# Altium project VCU 2.0.PrjPcb
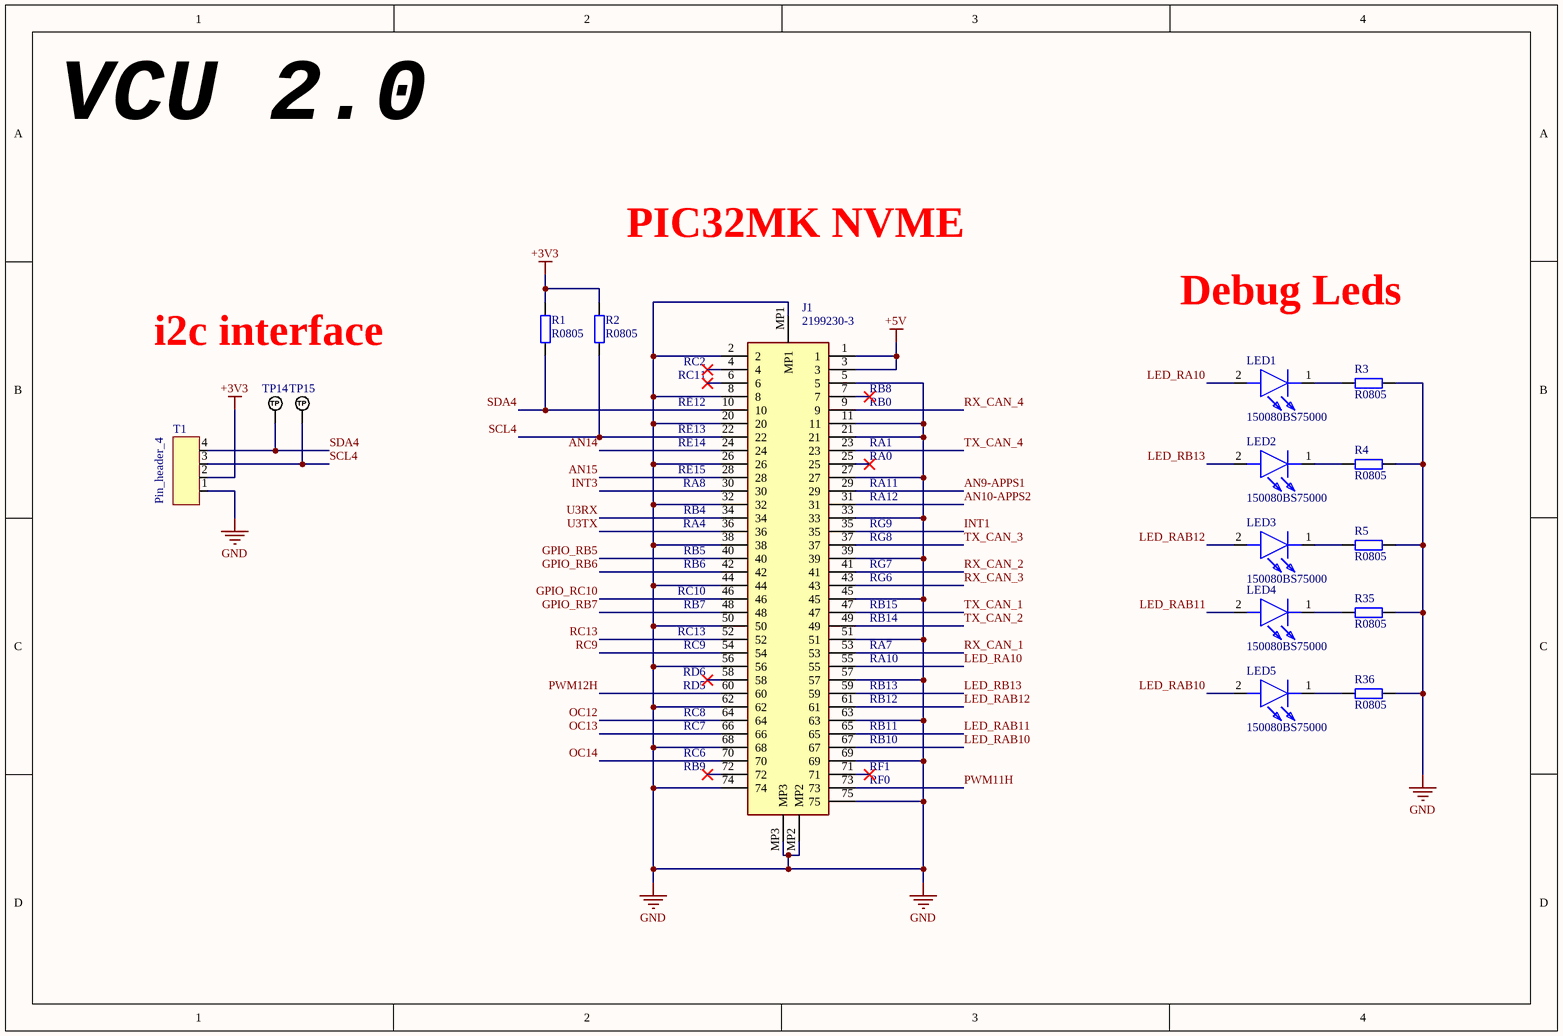
[diagram p0: PIC32_NVME.SchDoc]
6 sheets, 138 parts. Net scope: global (net labels, ports and power ports of the same name join across sheets).
Board file: VCU_V2_PCB.PcbDoc
Sheets:
  PIC32_NVME.SchDoc
  POWER.SchDoc
  CAN.SchDoc
  APPS.SchDoc
  MOSFETS.SchDoc
  OUTPUT.SchDoc

## Sheet PIC32_NVME.SchDoc
size A4; SheetNumber: 1; SheetTotal: 6

### Parts
J1  2199230-3  [21992303]
LED1  150080BS75000  [LEDC2012X80N]
LED2  150080BS75000  [LEDC2012X80N]
LED3  150080BS75000  [LEDC2012X80N]
LED4  150080BS75000  [LEDC2012X80N]
LED5  150080BS75000  [LEDC2012X80N]
R1  R0805  [RES_0805]
R2  R0805  [RES_0805]
R3  R0805  [RES_0805]
R4  R0805  [RES_0805]
R5  R0805  [RES_0805]
R35  R0805  [RES_0805]
R36  R0805  [RES_0805]
T1  Pin_header_4  [Pin_header_4]
TP14  TP_NOBOM  [PAD_RND_1MM]  (value not drawn)  (no BOM)
TP15  TP_NOBOM  [PAD_RND_1MM]  (value not drawn)  (no BOM)

### Nets
+3V3: R1.1 R2.1 T1.2
+5V: J1.1 J1.3
GND: J1.2 J1.5 J1.8 J1.11 J1.20 J1.21 J1.26 J1.27 J1.32 J1.33 J1.38 J1.39 J1.44 J1.45 J1.50 J1.51 J1.56 J1.57 J1.62 J1.63 J1.68 J1.69 J1.74 J1.75 J1.MP1 J1.MP2 J1.MP3 R3.1 R4.1 R5.1 R35.1 R36.1 T1.1
AN9-APPS1: J1.29
AN10-APPS2: J1.31
AN14: J1.24
AN15: J1.28
GPIO_RB5: J1.40
GPIO_RB6: J1.42
GPIO_RB7: J1.48
GPIO_RC10: J1.46
INT1: J1.35
INT3: J1.30
LED_RA10: J1.55 LED1.2(A)
LED_RAB10: J1.67 LED5.2(A)
LED_RAB11: J1.65 LED4.2(A)
LED_RAB12: J1.61 LED3.2(A)
LED_RB13: J1.59 LED2.2(A)
OC12: J1.64
OC13: J1.66
OC14: J1.70
PWM11H: J1.73
PWM12H: J1.60
RC9: J1.54
RC13: J1.52
RX_CAN_1: J1.53
RX_CAN_2: J1.41
RX_CAN_3: J1.43
RX_CAN_4: J1.9
SCL4: J1.22 R2.2 T1.3 TP15.1(TP)
SDA4: J1.10 R1.2 T1.4 TP14.1(TP)
TX_CAN_1: J1.47
TX_CAN_2: J1.49
TX_CAN_3: J1.37
TX_CAN_4: J1.23
U3RX: J1.34
U3TX: J1.36
NetLED1_1: LED1.1(K) R3.2
NetLED2_1: LED2.1(K) R4.2
NetLED3_1: LED3.1(K) R5.2
NetLED4_1: LED4.1(K) R35.2
NetLED5_1: LED5.1(K) R36.2

Not connected (* = marked no-connect by the designer): J1 4* 6* 7* 25* 58* 71* 72*

### Notes on the sheet
- VCU 2.0
- PIC32MK NVME
- Debug Leds
- i2c interface
- (near J1) RC2
- (near J1) RC11
- (near J1) RE12
- (near J1) RE13
- (near J1) RE14
- (near J1) RB0
- (near J1) RA1
- (near J1) RB8
- (near J1) RE15
- (near J1) RA8
- (near J1) RB4
- (near J1) RA0
- (near J1) RA11
- (near J1) RA12
- (near J1) RA4
- (near J1) RB5
- (near J1) RB6
- (near J1) RG7
- (near J1) RG8
- (near J1) RG6
- (near J1) RG9
- (near J1) RC10
- (near J1) RB7
- (near J1) RC13
- (near J1) RC9
- (near J1) RA7
- (near J1) RB15
- (near J1) RB14
- (near J1) RD6
- (near J1) RD5
- (near J1) RC8
- (near J1) RA10
- (near J1) RB13
- (near J1) RB12
- (near J1) RC7
- (near J1) RC6
- (near J1) RB9
- (near J1) RB11
- (near J1) RB10
- (near J1) RF1
- (near J1) RF0

### Library data of the parts
J1 = 2199230-3: Connector; Manufacturer_Name: TE Connectivity; Datasheet Link: https://componentsearchengine.com/Datasheets/2/2199230-3.pdf; Height: 4.2mm; Manufacturer_Part_Number: 2199230-3; Mouser Part Number: 571-2199230-3; Mouser Price/Stock: https://www.mouser.co.uk/ProductDetail/TE-Connectivity/2199230-3?qs=EQCnRgr4b6HElQOKr5ma1Q%3D%3D; Arrow Part Number: 2199230-3; Arrow Price/Stock: https://www.arrow.com/en/products/2199230-3/te-connectivity?region=nac
LED1-LED5 = 150080BS75000: LED; Manufacturer_Name: Wurth Elektronik; Datasheet Link: https://katalog.we-online.com/led/datasheet/150080BS75000.pdf; Height: 0.8mm; Manufacturer_Part_Number: 150080BS75000; Mouser Part Number: 710-150080BS75000; Mouser Price/Stock: https://www.mouser.co.uk/ProductDetail/Wurth-Elektronik/150080BS75000?qs=2kOmHSv6VfT2tBo3UPVqAQ%3D%3D
R1-R5 R35 R36 = RES_0805: Resistor SMD 0805; Manufacturer: *; Manufacturer Part Number: *; Distributor Link: *; LCSC: *
TP14 TP15 = TEST_POINT_RND_1MM: Test Point Round 1mm (NO BOM)

## Sheet POWER.SchDoc
size A4; SheetNumber: 2; SheetTotal: 6
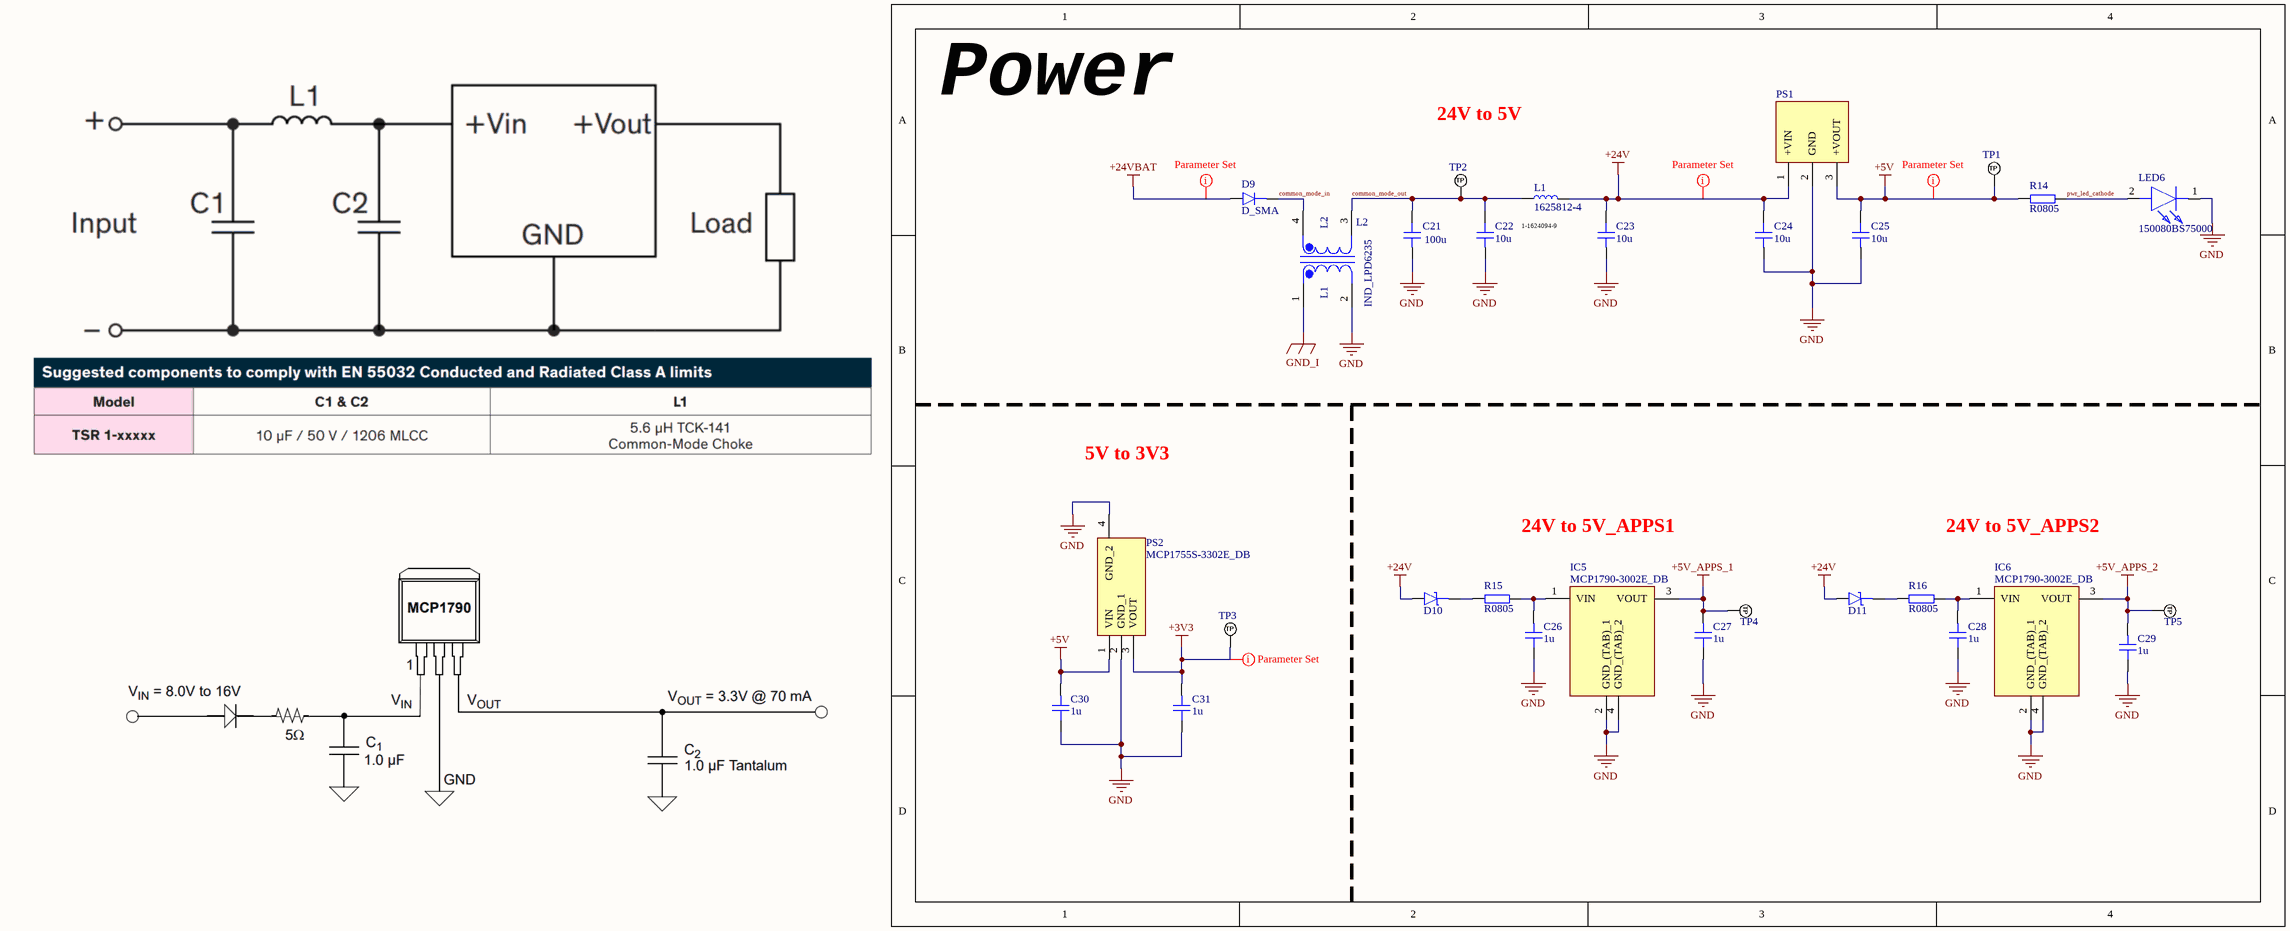
[diagram p1: POWER.SchDoc]

### Parts
C21  100u  [CAP_0805]
C22  10u  [CAP_0805]
C23  10u  [CAP_0805]
C24  10u  [CAP_0805]
C25  10u  [CAP_0805]
C26  1u  [CAP_0805]
C27  1u  [CAP_0805]
C28  1u  [CAP_0805]
C29  1u  [CAP_0805]
C30  1u  [CAP_0805]
C31  1u  [CAP_0805]
D9  D_SMA  [DO-214AC-2 (SMA)]
D10  D_SCHOTTKY_SOD_323  [SOD-323]  (value not drawn)
D11  D_SCHOTTKY_SOD_323  [SOD-323]  (value not drawn)
IC5  MCP1790-3002E_DB  [SOT230P700X180-4N]
IC6  MCP1790-3002E_DB  [SOT230P700X180-4N]
L1  1625812-4  [147873-2 smd button]
L2  IND_LPD6235  [IND_LPD6235]
LED6  150080BS75000  [LEDC2012X80N]
PS1  R-78E5.0-0.5  [R78E5005]  (value not drawn)
PS2  MCP1755S-3302E_DB  [SOT230P700X180-4N]
R14  R0805  [RES_0805]
R15  R0805  [RES_0805]
R16  R0805  [RES_0805]
TP1  TP_NOBOM  [PAD_RND_1MM]  (value not drawn)  (no BOM)
TP2  TP_NOBOM  [PAD_RND_1MM]  (value not drawn)  (no BOM)
TP3  TP_NOBOM  [PAD_RND_1MM]  (value not drawn)  (no BOM)
TP4  TP_NOBOM  [PAD_RND_1MM]  (value not drawn)  (no BOM)
TP5  TP_NOBOM  [PAD_RND_1MM]  (value not drawn)  (no BOM)

### Nets
+3V3: C31.1 PS2.3(VOUT) TP3.1(TP)
+5V: C25.2 C30.1 PS1.3(+VOUT) PS2.1(VIN) R14.1 TP1.1(TP)
+5V_APPS_1: C27.1 IC5.3(VOUT) TP4.1(TP)
+5V_APPS_2: C29.1 IC6.3(VOUT) TP5.1(TP)
+24V: C23.2 C24.2 D10.A D11.A L1.2 PS1.1(+VIN)
+24VBAT: D9.A
GND: C21.1 C22.1 C23.1 C24.1 C25.1 C26.2 C27.2 C28.2 C29.2 C30.2 C31.2 IC5.2(GND_(TAB)_1) IC5.4(GND_(TAB)_2) IC6.2(GND_(TAB)_1) IC6.4(GND_(TAB)_2) L2.2 LED6.1(K) PS1.2(GND) PS2.2(GND_1) PS2.4(GND_2)
GND_I: L2.1
common_mode_in: D9.K L2.4
common_mode_out: C21.2 C22.2 L1.1 L2.3 TP2.1(TP)
pwr_led_cathode: LED6.2(A) R14.2
NetC26_1: C26.1 IC5.1(VIN) R15.1
NetC28_1: C28.1 IC6.1(VIN) R16.1
NetD10_K: D10.K R15.2
NetD11_K: D11.K R16.2

### Layout directives
net class POWER: +3V3, +5V, +24V, +24VBAT

### Notes on the sheet
- Power
- 24V to 5V
- 1-1624094-9
- 5V to 3V3
- 24V to 5V_APPS1
- 24V to 5V_APPS2
- (in symbol IND_LPD6235) L1

### Library data of the parts
C21-C31 = CAP_0805_10V: Capacitor SMD 0805 10V
D9 = D_SMA: Diode SMD SMA (DO-214AA)
D10 D11 = D_SCHOTTKY_SOD_323: Diode Schottky SMD SOD-323
IC5 IC6 = MCP1790-3002E_DB: Integrated Circuit; Manufacturer_Name: Microchip; Manufacturer_Part_Number: MCP1790-3002E/DB; Datasheet Link: http://ww1.microchip.com/downloads/en/DeviceDoc/22075b.pdf; Height: 1.8mm; Mouser Part Number: 579-MCP1790-3002E/DB; Mouser Price/Stock: https://www.mouser.co.uk/ProductDetail/Microchip-Technology/MCP1790-3002E-DB?qs=gsqZ4L1luKroJ%252BBibcYbpw%3D%3D; Arrow Part Number: MCP1790-3002E/DB; Arrow Price/Stock: https://www.arrow.com/en/products/mcp1790-3002edb/microchip-technology?region=nac
L1 = Power_Inductor: TE 1625812-4
LED6 = 150080BS75000: LED; Manufacturer_Name: Wurth Elektronik; Datasheet Link: https://katalog.we-online.com/led/datasheet/150080BS75000.pdf; Height: 0.8mm; Manufacturer_Part_Number: 150080BS75000; Mouser Part Number: 710-150080BS75000; Mouser Price/Stock: https://www.mouser.co.uk/ProductDetail/Wurth-Elektronik/150080BS75000?qs=2kOmHSv6VfT2tBo3UPVqAQ%3D%3D
PS1 = R-78E5.0-0.5: Power Supply; Manufacturer_Name: RECOM Power; Datasheet Link: https://datasheet.datasheetarchive.com/originals/distributors/Datasheets_SAMA/1560217c2d38d5ce10907af13420fc49.pdf; Height: 10.9mm; Manufacturer_Part_Number: R-78E5.0-0.5; Mouser Part Number: 919-R-78E5.0-0.5; Mouser Price/Stock: https://www.mouser.co.uk/ProductDetail/RECOM-Power/R-78E5.0-0.5?qs=JeAkOuORR2UvBuiB2kZVZQ%3D%3D; Arrow Part Number: R-78E5.0-0.5; Arrow Price/Stock: https://www.arrow.com/en/products/r-78e5.0-0.5/recom-power?region=europe
PS2 = MCP1755S-3302E_DB: Power Supply; Manufacturer_Name: Microchip; Manufacturer_Part_Number: MCP1755S-3302E/DB; Datasheet Link: http://www.farnell.com/datasheets/1697992.pdf; Height: 1.8mm; Mouser Part Number: 579-MCP1755S-3302EDB; Mouser Price/Stock: https://www.mouser.co.uk/ProductDetail/Microchip-Technology/MCP1755S-3302E-DB?qs=OCR3PNzn1cc7Hxpx9CIZgA%3D%3D; Arrow Part Number: MCP1755S-3302E/DB; Arrow Price/Stock: https://www.arrow.com/en/products/mcp1755s-3302edb/microchip-technology?region=nac
R14-R16 = RES_0805: Resistor SMD 0805; Manufacturer: *; Manufacturer Part Number: *; Distributor Link: *; LCSC: *
TP1-TP5 = TEST_POINT_RND_1MM: Test Point Round 1mm (NO BOM)

## Sheet CAN.SchDoc
size A3; SheetNumber: 3; SheetTotal: 5
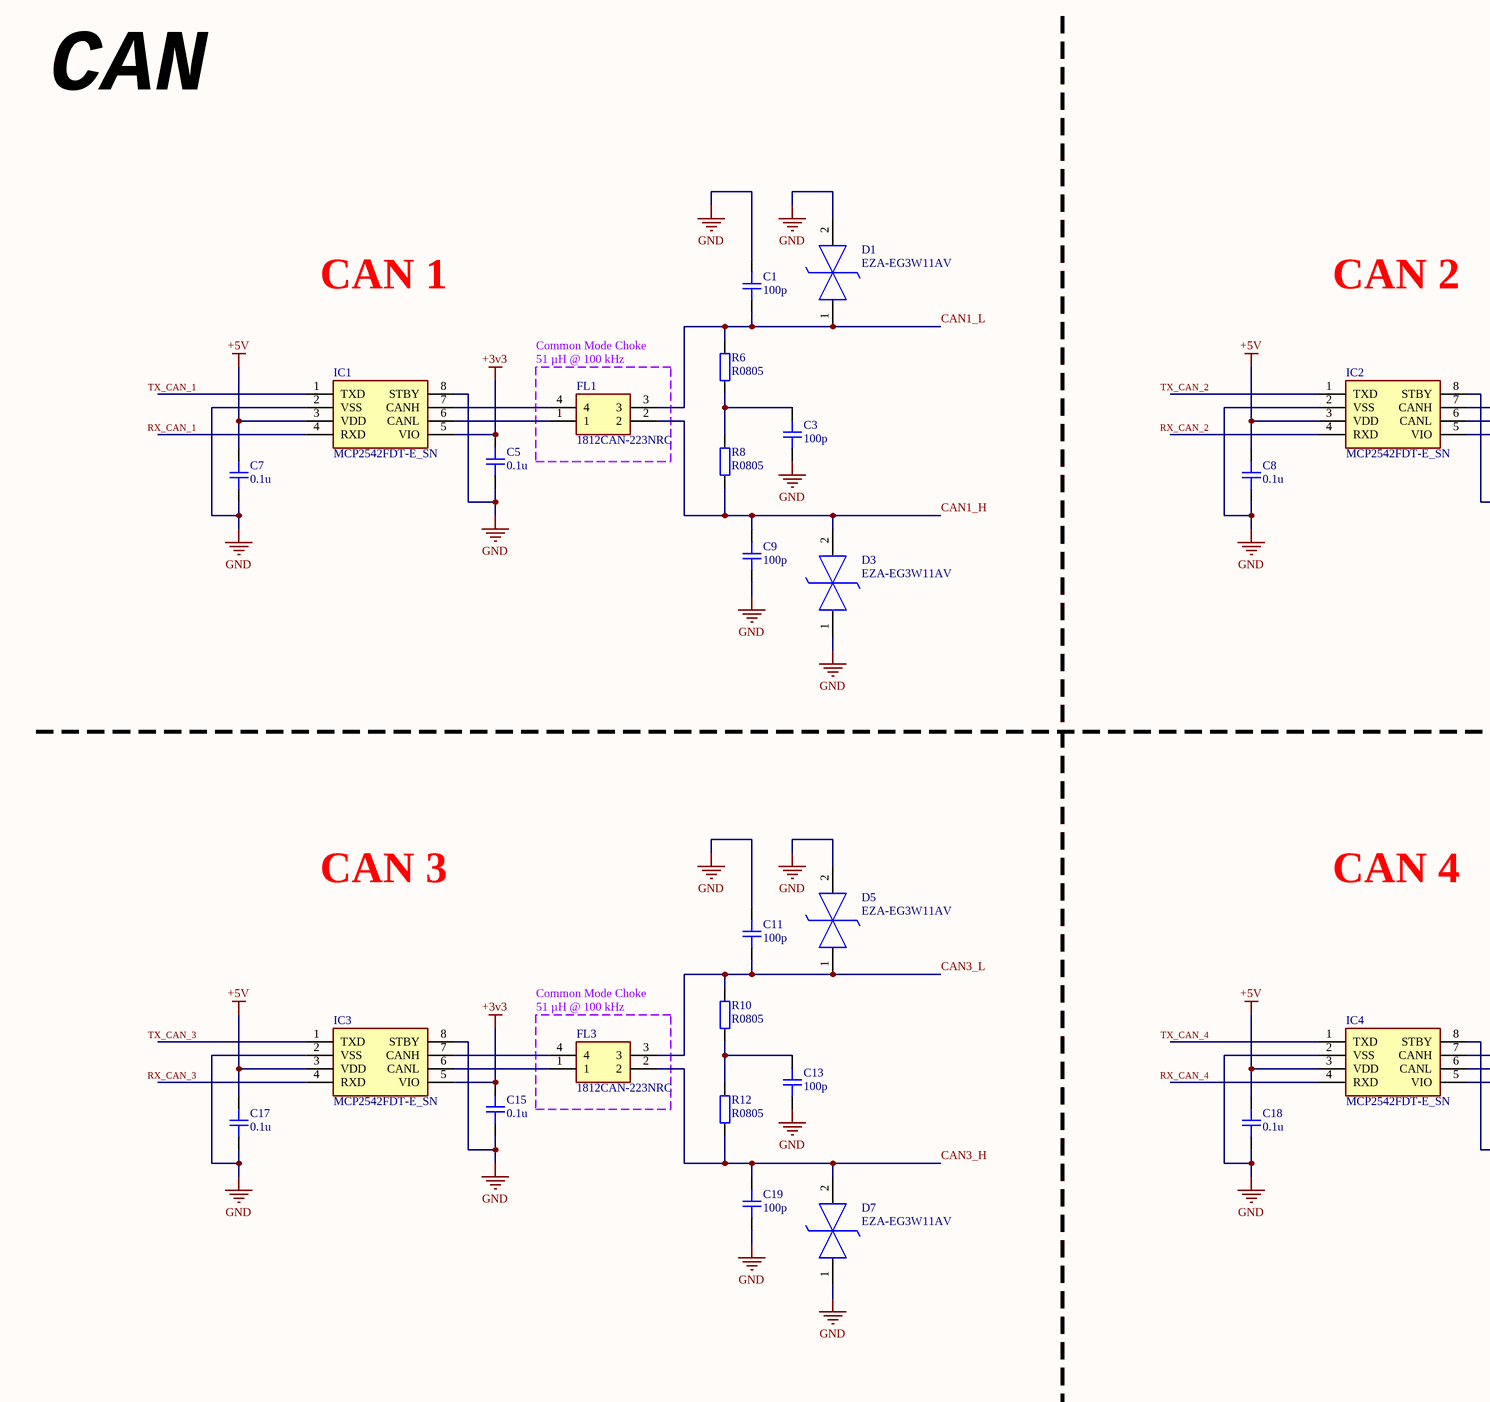
[diagram p2: CAN.SchDoc, left]
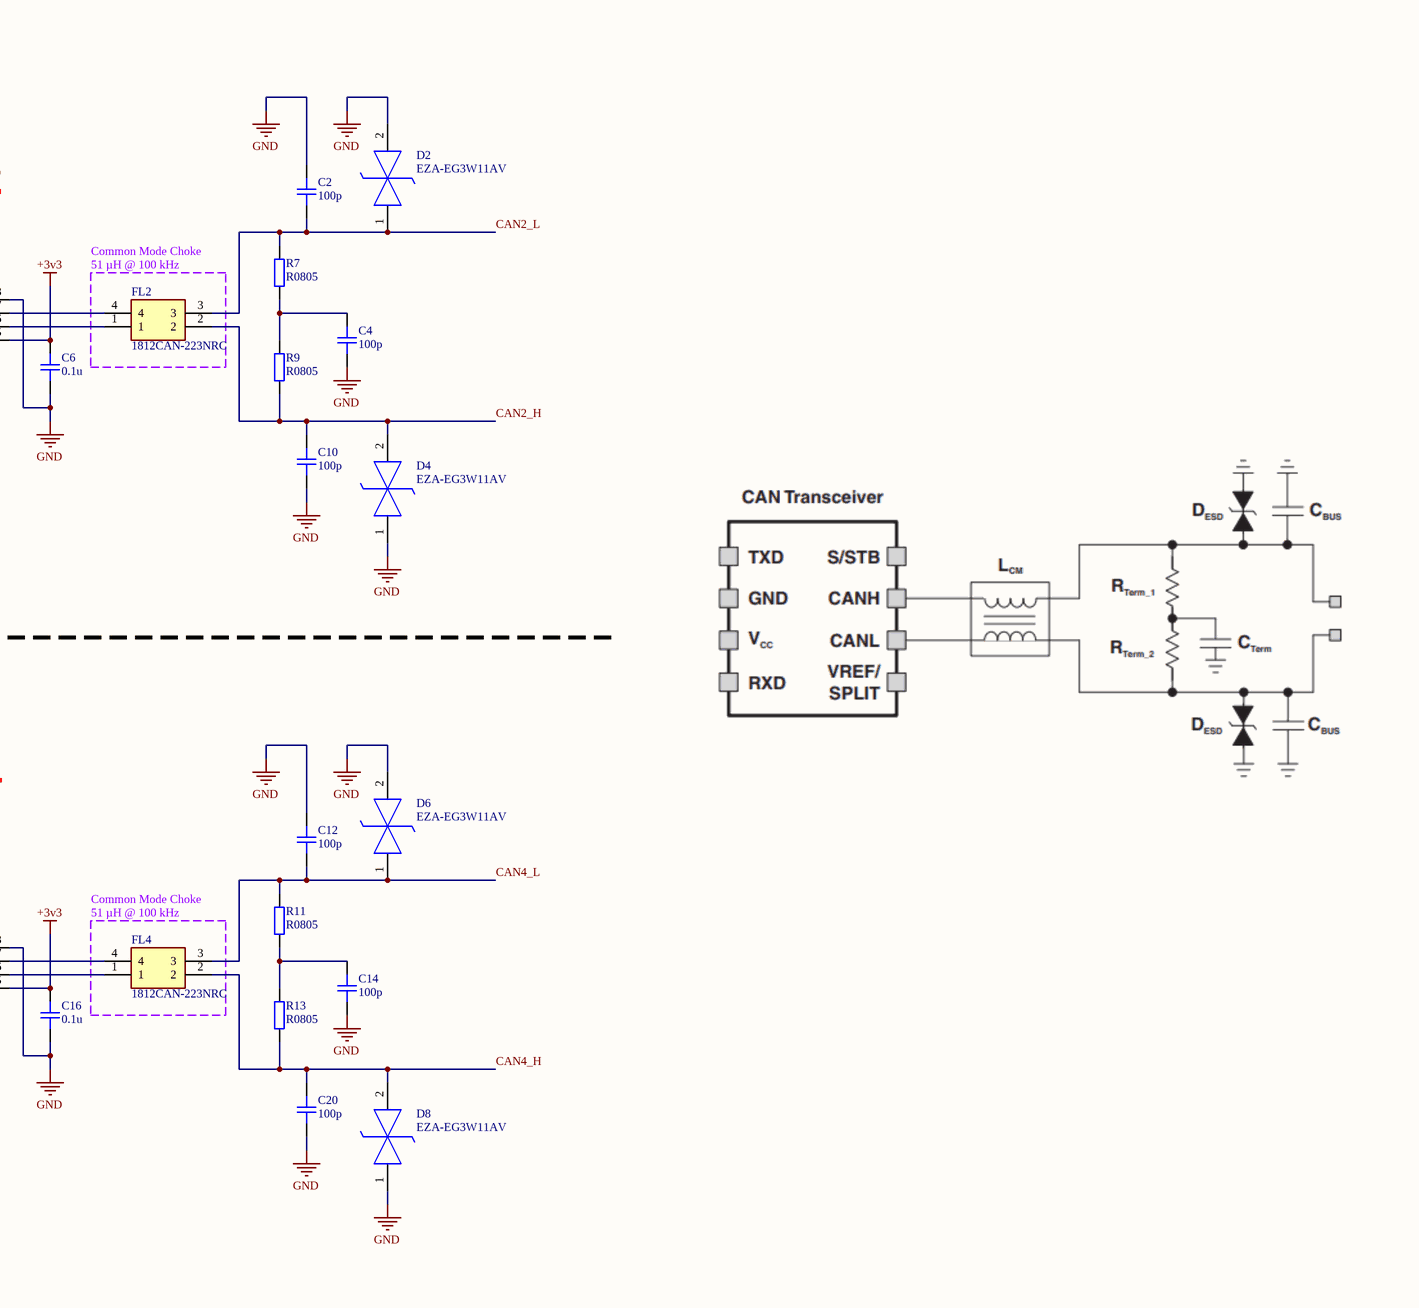
[diagram p3: CAN.SchDoc, right]

### Parts
C1  100p  [CAP_0805]
C2  100p  [CAP_0805]
C3  100p  [CAP_0805]
C4  100p  [CAP_0805]
C5  0.1u  [CAP_0805]
C6  0.1u  [CAP_0805]
C7  0.1u  [CAP_0805]
C8  0.1u  [CAP_0805]
C9  100p  [CAP_0805]
C10  100p  [CAP_0805]
C11  100p  [CAP_0805]
C12  100p  [CAP_0805]
C13  100p  [CAP_0805]
C14  100p  [CAP_0805]
C15  0.1u  [CAP_0805]
C16  0.1u  [CAP_0805]
C17  0.1u  [CAP_0805]
C18  0.1u  [CAP_0805]
C19  100p  [CAP_0805]
C20  100p  [CAP_0805]
D1  EZA-EG3W11AV  [EZAEG3W11AV]
D2  EZA-EG3W11AV  [EZAEG3W11AV]
D3  EZA-EG3W11AV  [EZAEG3W11AV]
D4  EZA-EG3W11AV  [EZAEG3W11AV]
D5  EZA-EG3W11AV  [EZAEG3W11AV]
D6  EZA-EG3W11AV  [EZAEG3W11AV]
D7  EZA-EG3W11AV  [EZAEG3W11AV]
D8  EZA-EG3W11AV  [EZAEG3W11AV]
FL1  1812CAN-223NRC  [1812CAN223NRC]
FL2  1812CAN-223NRC  [1812CAN223NRC]
FL3  1812CAN-223NRC  [1812CAN223NRC]
FL4  1812CAN-223NRC  [1812CAN223NRC]
IC1  MCP2542FDT-E_SN  [SOIC127P600X175-8N]
IC2  MCP2542FDT-E_SN  [SOIC127P600X175-8N]
IC3  MCP2542FDT-E_SN  [SOIC127P600X175-8N]
IC4  MCP2542FDT-E_SN  [SOIC127P600X175-8N]
R6  R0805  [RES_0805]
R7  R0805  [RES_0805]
R8  R0805  [RES_0805]
R9  R0805  [RES_0805]
R10  R0805  [RES_0805]
R11  R0805  [RES_0805]
R12  R0805  [RES_0805]
R13  R0805  [RES_0805]

### Nets
+3V3: C5.2 C6.2 C15.2 C16.2 IC1.5(VIO) IC2.5(VIO) IC3.5(VIO) IC4.5(VIO)
+5V: C7.2 C8.2 C17.2 C18.2 IC1.3(VDD) IC2.3(VDD) IC3.3(VDD) IC4.3(VDD)
GND: C1.1 C2.1 C3.2 C4.2 C5.1 C6.1 C7.1 C8.1 C9.2 C10.2 C11.1 C12.1 C13.2 C14.2 C15.1 C16.1 C17.1 C18.1 C19.2 C20.2 D1.2(K2) D2.2(K2) D3.1(K1) D4.1(K1) D5.2(K2) D6.2(K2) D7.1(K1) D8.1(K1) IC1.2(VSS) IC1.8(STBY) IC2.2(VSS) IC2.8(STBY) IC3.2(VSS) IC3.8(STBY) IC4.2(VSS) IC4.8(STBY)
CAN1_H: C9.1 D3.2(K2) FL1.2 R8.1
CAN1_L: C1.2 D1.1(K1) FL1.3 R6.2
CAN2_H: C10.1 D4.2(K2) FL2.2 R9.1
CAN2_L: C2.2 D2.1(K1) FL2.3 R7.2
CAN3_H: C19.1 D7.2(K2) FL3.2 R12.1
CAN3_L: C11.2 D5.1(K1) FL3.3 R10.2
CAN4_H: C20.1 D8.2(K2) FL4.2 R13.1
CAN4_L: C12.2 D6.1(K1) FL4.3 R11.2
RX_CAN_1: IC1.4(RXD)
RX_CAN_2: IC2.4(RXD)
RX_CAN_3: IC3.4(RXD)
RX_CAN_4: IC4.4(RXD)
TX_CAN_1: IC1.1(TXD)
TX_CAN_2: IC2.1(TXD)
TX_CAN_3: IC3.1(TXD)
TX_CAN_4: IC4.1(TXD)
NetC3_1: C3.1 R6.1 R8.2
NetC4_1: C4.1 R7.1 R9.2
NetC13_1: C13.1 R10.1 R12.2
NetC14_1: C14.1 R11.1 R13.2
NetFL1_1: FL1.1 IC1.6(CANL)
NetFL1_4: FL1.4 IC1.7(CANH)
NetFL2_1: FL2.1 IC2.6(CANL)
NetFL2_4: FL2.4 IC2.7(CANH)
NetFL3_1: FL3.1 IC3.6(CANL)
NetFL3_4: FL3.4 IC3.7(CANH)
NetFL4_1: FL4.1 IC4.6(CANL)
NetFL4_4: FL4.4 IC4.7(CANH)

### Notes on the sheet
- CAN
- CAN 1
- CAN 2
- (near FL1) Common Mode Choke
  51 µH @ 100 kHz
- (near FL2) Common Mode Choke
  51 µH @ 100 kHz
- CAN 3
- CAN 4
- (near FL3) Common Mode Choke
  51 µH @ 100 kHz
- (near FL4) Common Mode Choke
  51 µH @ 100 kHz

### Library data of the parts
C1-C20 = CAP_0805_10V: Capacitor SMD 0805 10V
D1-D8 = EZA-EG3W11AV: Diode ESD (Bi-directional); Manufacturer_Name: Panasonic; Datasheet Link: https://industrial.panasonic.com/cdbs/www-data/pdf/AWD0000/AWD0000C26.pdf; Height: 0.5mm; Manufacturer_Part_Number: EZA-EG3W11AV; Mouser Part Number: 667-EZA-EG3W11AV; Mouser Price/Stock: https://www.mouser.co.uk/ProductDetail/Panasonic/EZA-EG3W11AV?qs=0lSvoLzn4L%252BhlS%252B2lqbWqw%3D%3D; Arrow Part Number: EZA-EG3W11AV; Arrow Price/Stock: https://www.arrow.com/en/products/eza-eg3w11av/panasonic; Simulation Data: https://industrial.panasonic.com/content/data/CC/files/EZAEG3W11AV.zip
FL1-FL4 = 1812CAN-223NRC: Filter; Manufacturer_Name: COILCRAFT; Datasheet Link: https://www.coilcraft.com/getmedia/07970769-ca48-411d-9c96-6ae867bbb31e/1812can.pdf; Height: 3mm; Manufacturer_Part_Number: 1812CAN-223NRC; Mouser Part Number: 994-1812CAN-223NRC; Mouser Price/Stock: https://www.mouser.co.uk/ProductDetail/Coilcraft/1812CAN-223NRC?qs=wnTfsH77Xs58ULcmqHaGYA%3D%3D
IC1-IC4 = MCP2542FDT-E_SN: Integrated Circuit; Manufacturer_Name: Microchip; Manufacturer_Part_Number: MCP2542FDT-E/SN; Datasheet Link: https://ww1.microchip.com/downloads/en/DeviceDoc/MCP2542FD-MCP2542WFD-4WFD-Data-Sheet-DS20005514C.pdf; Height: 1.75mm; Mouser Part Number: 579-MCP2542FDT-E/SN; Mouser Price/Stock: https://www.mouser.co.uk/ProductDetail/Microchip-Technology-Atmel/MCP2542FDT-E-SN?qs=qdgZG5p0FZ7dgTYBMrlrQQ%3D%3D; Arrow Part Number: MCP2542FDT-E/SN; Arrow Price/Stock: https://www.arrow.com/en/products/mcp2542fdt-esn/microchip-technology?region=nac
R6-R13 = RES_0805: Resistor SMD 0805; Manufacturer: *; Manufacturer Part Number: *; Distributor Link: *; LCSC: *

## Sheet APPS.SchDoc
size A4; SheetNumber: 4; SheetTotal: 6
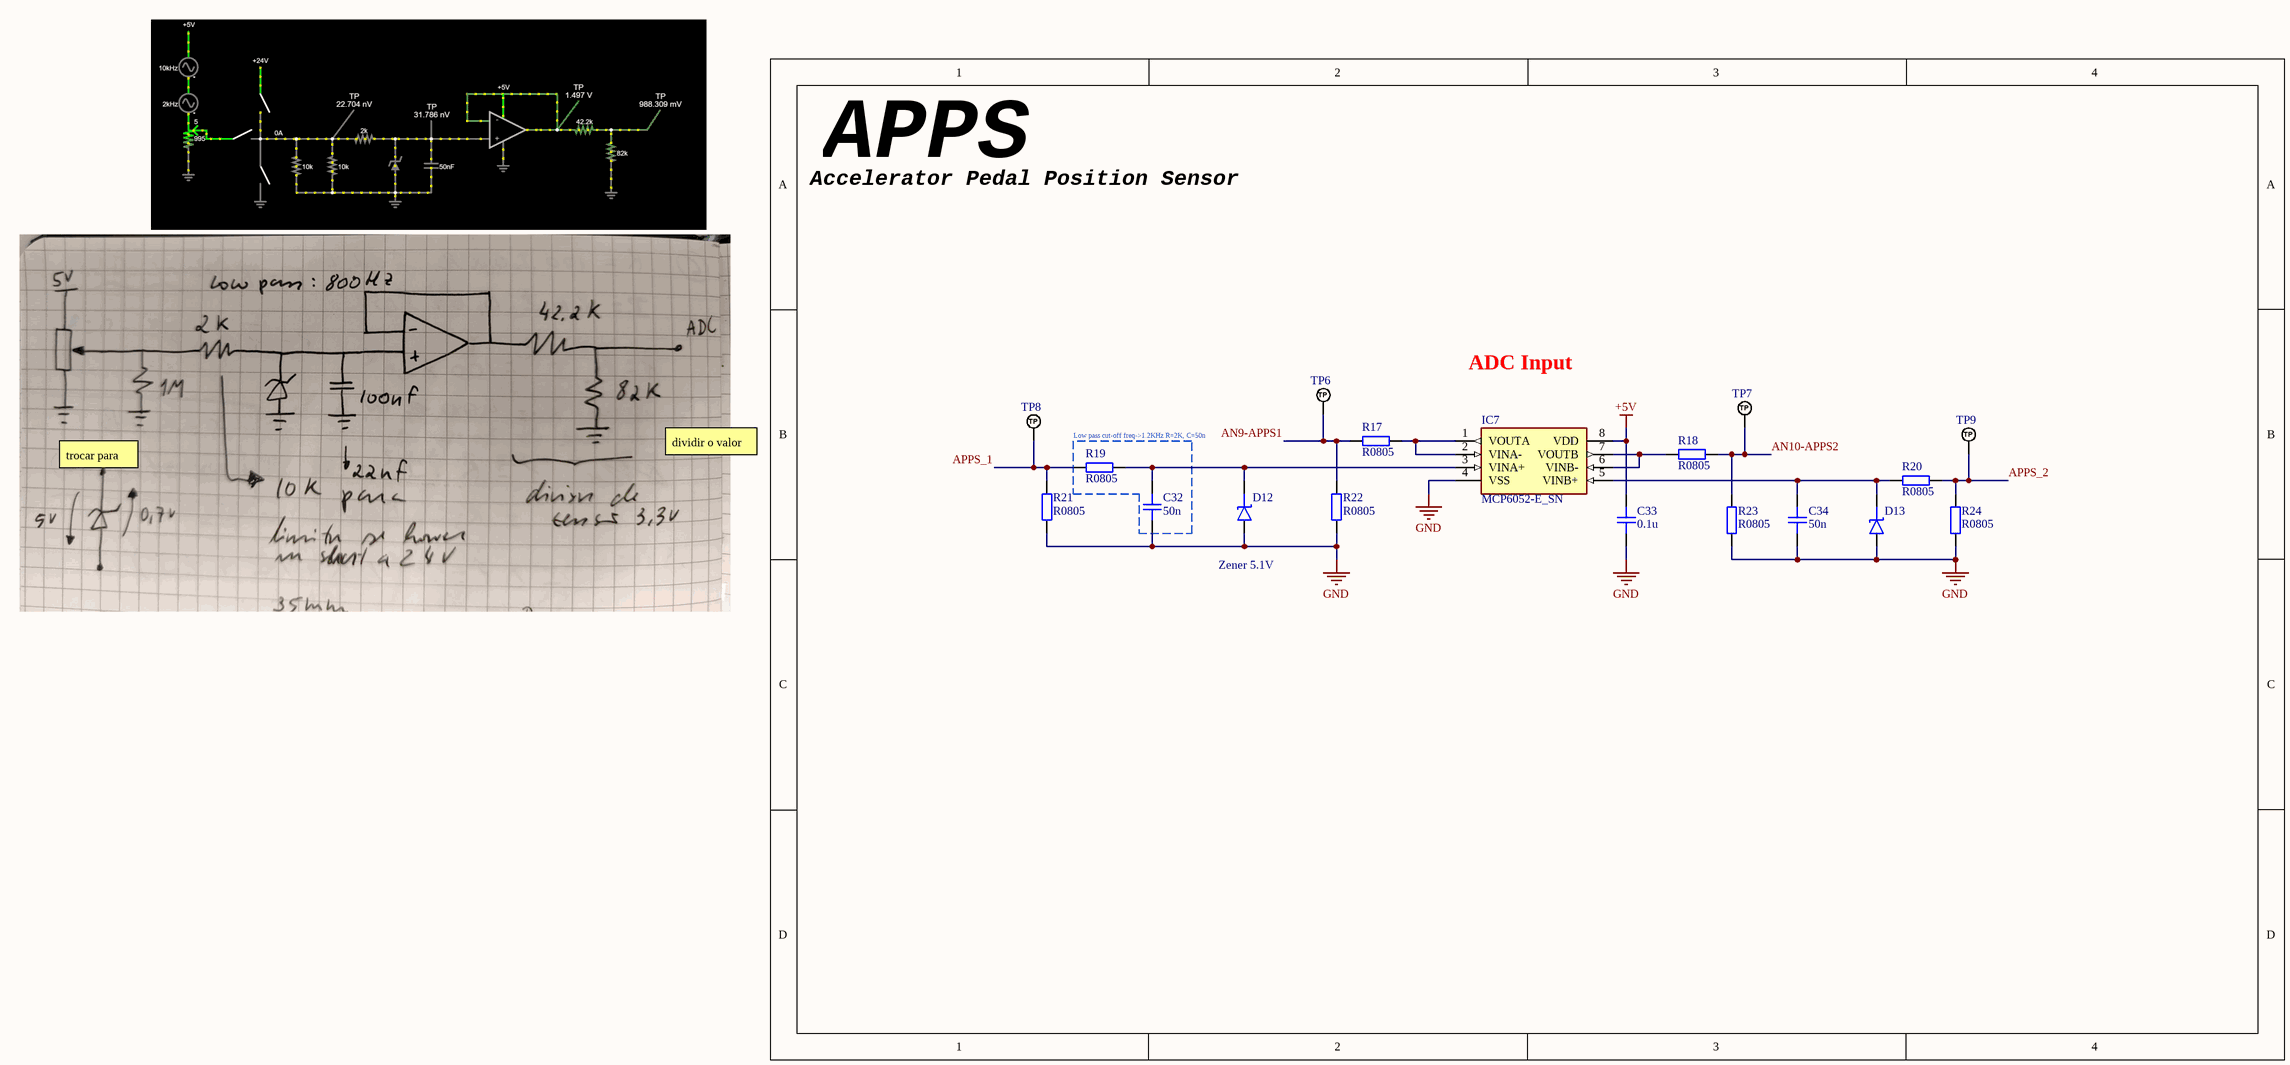
[diagram p4: APPS.SchDoc]

### Parts
C32  50n  [CAP_0805]
C33  0.1u  [CAP_0805]
C34  50n  [CAP_0805]
D12  D_SCHOTTKY_SOD_323  [SOD-323]  (value not drawn)
D13  D_SCHOTTKY_SOD_323  [SOD-323]  (value not drawn)
IC7  MCP6052-E_SN  [SOIC127P600X175-8N]
R17  R0805  [RES_0805]
R18  R0805  [RES_0805]
R19  R0805  [RES_0805]
R20  R0805  [RES_0805]
R21  R0805  [RES_0805]
R22  R0805  [RES_0805]
R23  R0805  [RES_0805]
R24  R0805  [RES_0805]
TP6  TP_NOBOM  [PAD_RND_1MM]  (value not drawn)  (no BOM)
TP7  TP_NOBOM  [PAD_RND_1MM]  (value not drawn)  (no BOM)
TP8  TP_NOBOM  [PAD_RND_1MM]  (value not drawn)  (no BOM)
TP9  TP_NOBOM  [PAD_RND_1MM]  (value not drawn)  (no BOM)

### Blocks framed on the sheet
Low pass cut-off freq->1.2KHz R=2K, C=50n: C32 R19

### Nets
+5V: C33.2 IC7.8(VDD)
GND: C32.2 C33.1 C34.2 D12.A D13.A IC7.4(VSS) R21.1 R22.2 R23.2 R24.1
AN9-APPS1: R17.2 R22.1 TP6.1(TP)
AN10-APPS2: R18.1 R23.1 TP7.1(TP)
APPS_1: R19.1 R21.2 TP8.1(TP)
APPS_2: R20.2 R24.2 TP9.1(TP)
NetC32_1: C32.1 D12.K IC7.3(VINA+) R19.2
NetC34_1: C34.1 D13.K IC7.5(VINB+) R20.1
NetIC7_1: IC7.1(VOUTA) IC7.2(VINA-) R17.1
NetIC7_6: IC7.6(VINB-) IC7.7(VOUTB) R18.2

### Notes on the sheet
- Accelerator Pedal Position Sensor
- APPS
- ADC Input
- trocar para 100k
- dividir o valor das resistencias por 10
- (near D12) Zener 5.1V

### Library data of the parts
C32-C34 = CAP_0805_10V: Capacitor SMD 0805 10V
D12 D13 = D_SCHOTTKY_SOD_323: Diode Schottky SMD SOD-323
IC7 = MCP6052-E_SN: Integrated Circuit; Manufacturer_Name: Microchip; Manufacturer_Part_Number: MCP6052-E/SN; Datasheet Link: http://ww1.microchip.com/downloads/en/DeviceDoc/MCP6051_DS22182B.pdf; Height: 1.75mm; Mouser Part Number: 579-MCP6052-E/SN; Mouser Price/Stock: https://www.mouser.com/Search/Refine.aspx?Keyword=579-MCP6052-E%2FSN
R17-R24 = RES_0805: Resistor SMD 0805; Manufacturer: *; Manufacturer Part Number: *; Distributor Link: *; LCSC: *
TP6-TP9 = TEST_POINT_RND_1MM: Test Point Round 1mm (NO BOM)

## Sheet MOSFETS.SchDoc
size A4; SheetNumber: 5; SheetTotal: 6
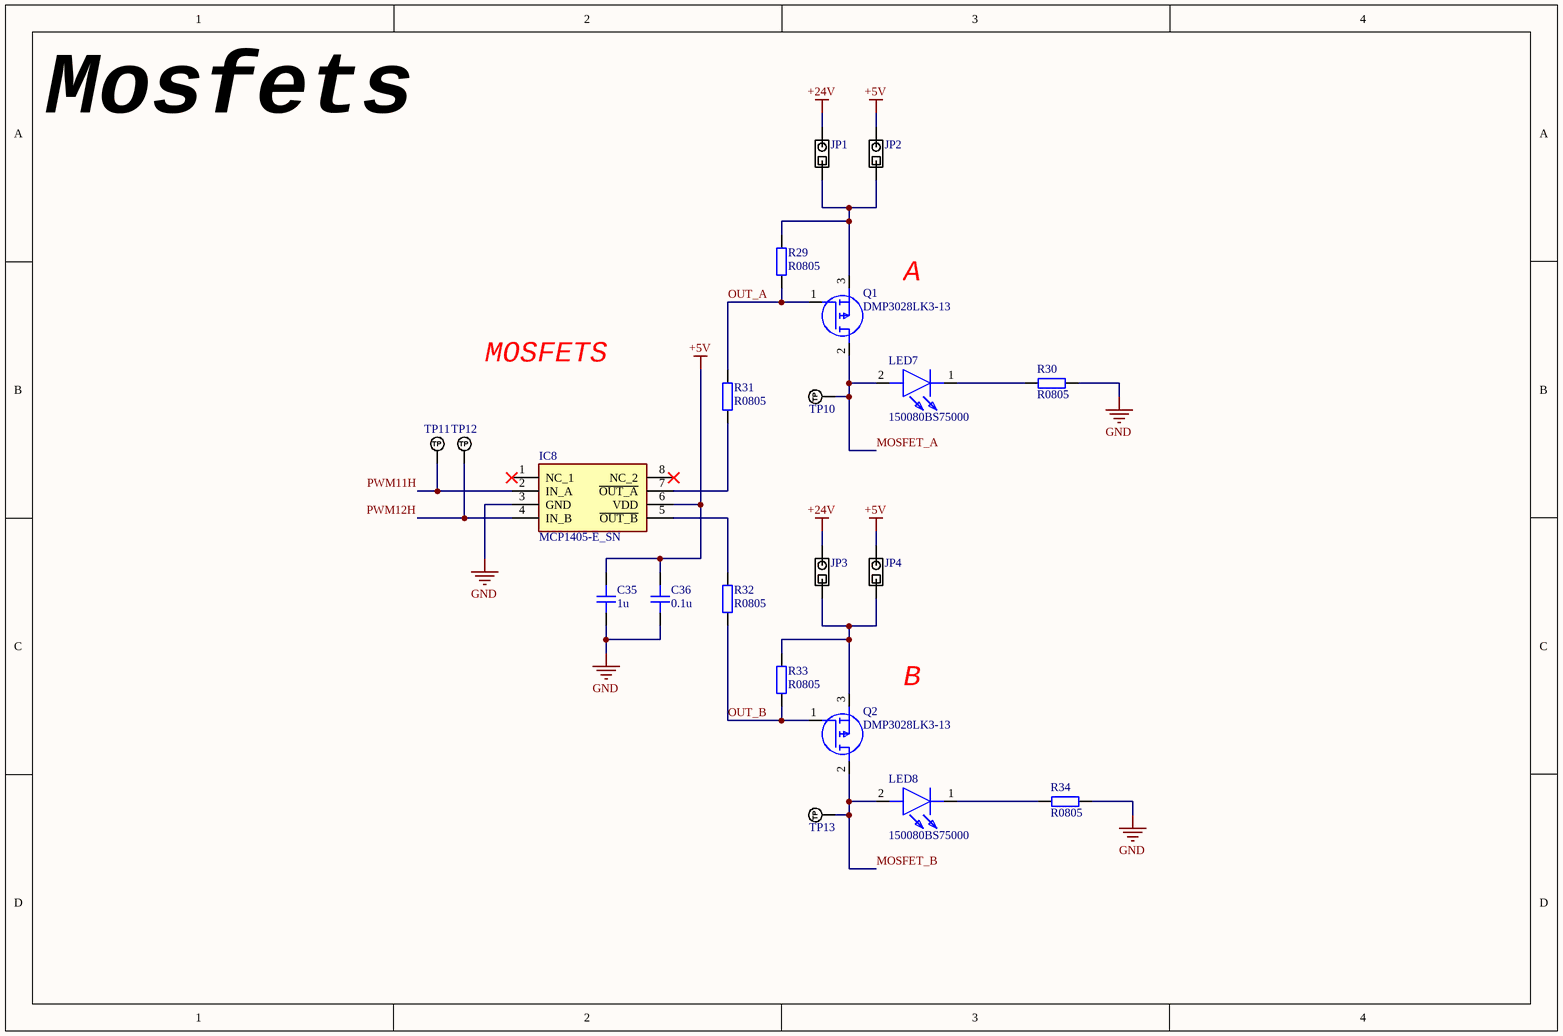
[diagram p5: MOSFETS.SchDoc]

### Parts
C35  1u  [CAP_0805]
C36  0.1u  [CAP_0805]
IC8  MCP1405-E_SN  [SOIC127P600X175-8N]
JP1  Solder Jumper  [SolderJumper_Single]  (value not drawn)
JP2  Solder Jumper  [SolderJumper_Single]  (value not drawn)
JP3  Solder Jumper  [SolderJumper_Single]  (value not drawn)
JP4  Solder Jumper  [SolderJumper_Single]  (value not drawn)
LED7  150080BS75000  [LEDC2012X80N]
LED8  150080BS75000  [LEDC2012X80N]
Q1  DMP3028LK3-13  [DMP3028LK313]
Q2  DMP3028LK3-13  [DMP3028LK313]
R29  R0805  [RES_0805]
R30  R0805  [RES_0805]
R31  R0805  [RES_0805]
R32  R0805  [RES_0805]
R33  R0805  [RES_0805]
R34  R0805  [RES_0805]
TP10  TP_NOBOM  [PAD_RND_1MM]  (value not drawn)  (no BOM)
TP11  TP_NOBOM  [PAD_RND_1MM]  (value not drawn)  (no BOM)
TP12  TP_NOBOM  [PAD_RND_1MM]  (value not drawn)  (no BOM)
TP13  TP_NOBOM  [PAD_RND_1MM]  (value not drawn)  (no BOM)

### Nets
+5V: C35.2 C36.2 IC8.6(VDD) JP2.2 JP4.2
+24V: JP1.2 JP3.2
GND: C35.1 C36.1 IC8.3(GND) R30.1 R34.1
MOSFET_A: LED7.2(A) Q1.2(D) TP10.1(TP)
MOSFET_B: LED8.2(A) Q2.2(D) TP13.1(TP)
OUT_A: Q1.1(G) R29.1 R31.2
OUT_B: Q2.1(G) R32.1 R33.1
PWM11H: IC8.2(IN_A) TP11.1(TP)
PWM12H: IC8.4(IN_B) TP12.1(TP)
NetIC8_5: IC8.5(~{OUT_B}) R32.2
NetIC8_7: IC8.7(~{OUT_A}) R31.1
NetJP1_1: JP1.1 JP2.1 Q1.3(S) R29.2
NetJP3_1: JP3.1 JP4.1 Q2.3(S) R33.2
NetLED7_1: LED7.1(K) R30.2
NetLED8_1: LED8.1(K) R34.2

Not connected (* = marked no-connect by the designer): IC8 1(NC_1)* 8(NC_2)*

### Notes on the sheet
- Mosfets
- A
- MOSFETS
- B

### Library data of the parts
C35 C36 = CAP_0805_10V: Capacitor SMD 0805 10V
IC8 = MCP1405-E_SN: Integrated Circuit; Manufacturer_Name: Microchip; Manufacturer_Part_Number: MCP1405-E/SN; Datasheet Link: https://datasheet.datasheetarchive.com/originals/distributors/SFDatasheet-4/sf-00090019.pdf; Height: 1.75mm; Mouser Part Number: 579-MCP1405-E/SN; Mouser Price/Stock: https://www.mouser.co.uk/ProductDetail/Microchip-Technology/MCP1405-E-SN?qs=usxtMOJb1Rz6iJkGGONxgg%3D%3D; Arrow Part Number: MCP1405-E/SN; Arrow Price/Stock: https://www.arrow.com/en/products/mcp1405-esn/microchip-technology
JP1-JP4 = SolderJumper_Single: Solder Jumper Single 0.5mm Pitch
LED7 LED8 = 150080BS75000: LED; Manufacturer_Name: Wurth Elektronik; Datasheet Link: https://katalog.we-online.com/led/datasheet/150080BS75000.pdf; Height: 0.8mm; Manufacturer_Part_Number: 150080BS75000; Mouser Part Number: 710-150080BS75000; Mouser Price/Stock: https://www.mouser.co.uk/ProductDetail/Wurth-Elektronik/150080BS75000?qs=2kOmHSv6VfT2tBo3UPVqAQ%3D%3D
Q1 Q2 = DMP3028LK3-13: MOSFET (P-Channel); Manufacturer_Name: Diodes Inc.; Datasheet Link: https://componentsearchengine.com/Datasheets/1/DMP3028LK3-13.pdf; Height: 2.39mm; Manufacturer_Part_Number: DMP3028LK3-13; Mouser Part Number: 621-DMP3028LK3-13; Mouser Price/Stock: https://www.mouser.co.uk/ProductDetail/Diodes-Incorporated/DMP3028LK3-13?qs=OVC8WVYZliSFpRP3sPErZQ%3D%3D; Arrow Part Number: DMP3028LK3-13; Arrow Price/Stock: https://www.arrow.com/en/products/dmp3028lk3-13/diodes-incorporated
R29-R34 = RES_0805: Resistor SMD 0805
TP10-TP13 = TEST_POINT_RND_1MM: Test Point Round 1mm (NO BOM)

## Sheet OUTPUT.SchDoc
size A4; SheetNumber: 6; SheetTotal: 6
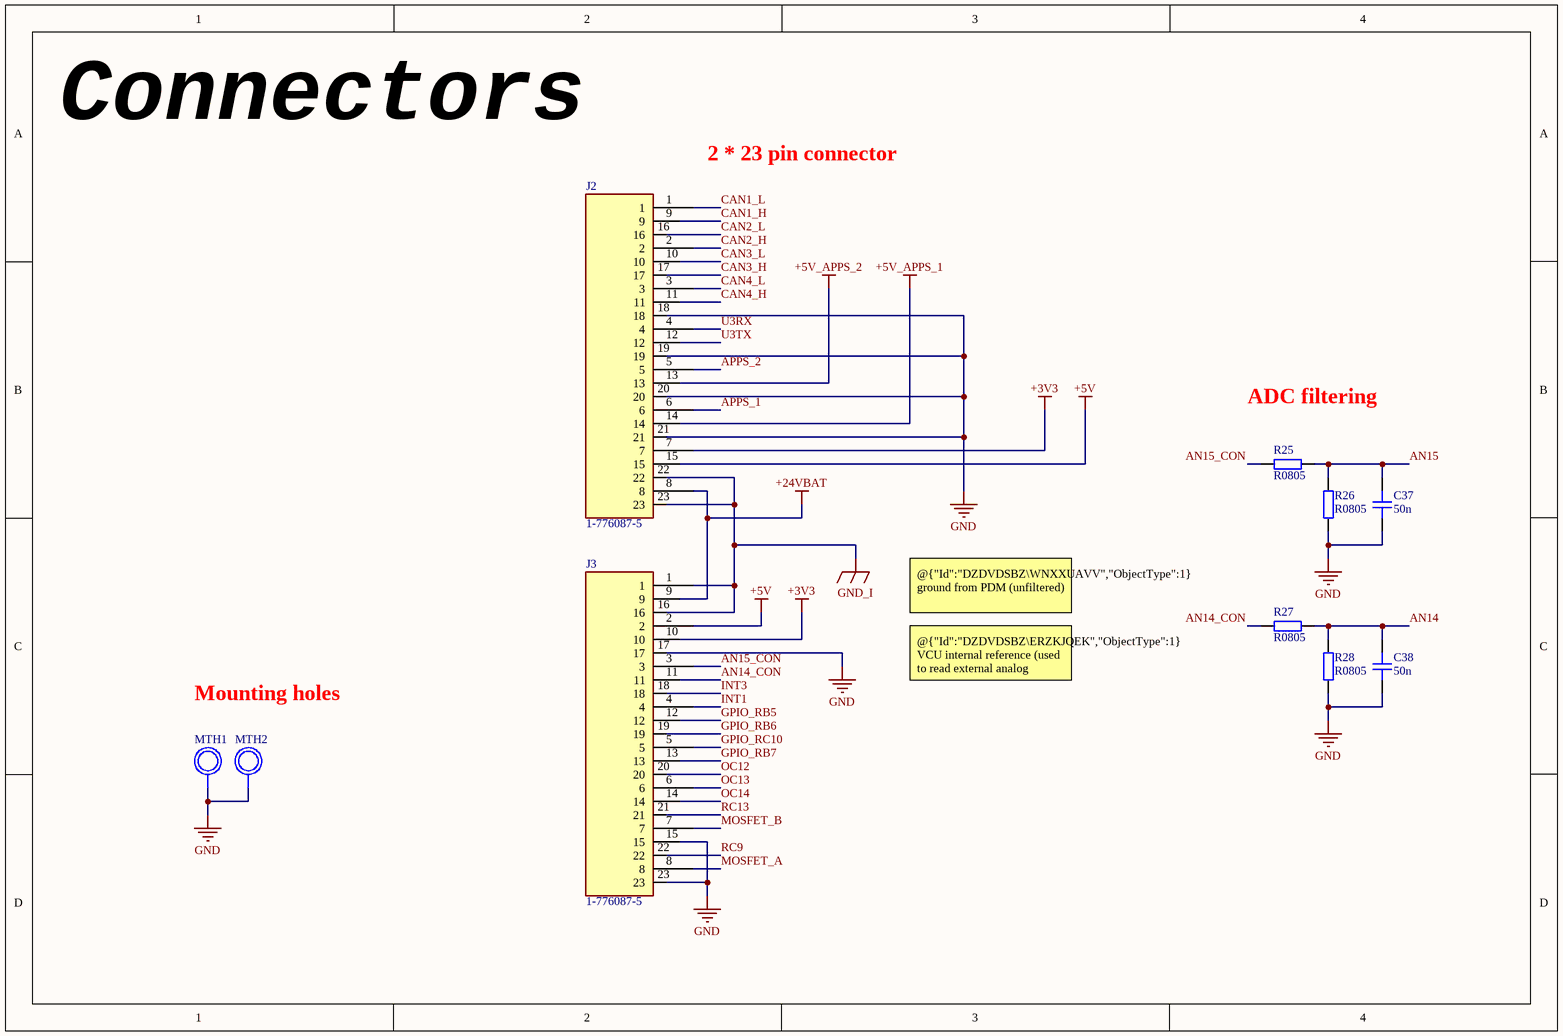
[diagram p6: OUTPUT.SchDoc]

### Parts
C37  50n  [CAP_0805]
C38  50n  [CAP_0805]
J2  1-776087-5  [1-776087-5]
J3  1-776087-5  [1-776087-5]
MTH1  Mounting_Hole_3.5mm  [Mounting_Hole_3.5mm]  (value not drawn)
MTH2  Mounting_Hole_3.5mm  [Mounting_Hole_3.5mm]  (value not drawn)
R25  R0805  [RES_0805]
R26  R0805  [RES_0805]
R27  R0805  [RES_0805]
R28  R0805  [RES_0805]

### Nets
+3V3: J2.7 J3.10
+5V: J2.15 J3.2
+5V_APPS_1: J2.14
+5V_APPS_2: J2.13
+24VBAT: J2.8 J3.9
GND: C37.2 C38.2 J2.18 J2.19 J2.20 J2.21 J3.15 J3.17 J3.23 MTH1.1 MTH2.1 R26.2 R28.2
GND_I: J2.22 J2.23 J3.1 J3.16
AN14: C38.1 R27.1 R28.1
AN14_CON: J3.11 R27.2
AN15: C37.1 R25.1 R26.1
AN15_CON: J3.3 R25.2
APPS_1: J2.6
APPS_2: J2.5
CAN1_H: J2.9
CAN1_L: J2.1
CAN2_H: J2.2
CAN2_L: J2.16
CAN3_H: J2.17
CAN3_L: J2.10
CAN4_H: J2.11
CAN4_L: J2.3
GPIO_RB5: J3.12
GPIO_RB6: J3.19
GPIO_RB7: J3.13
GPIO_RC10: J3.5
INT1: J3.4
INT3: J3.18
MOSFET_A: J3.8
MOSFET_B: J3.7
OC12: J3.20
OC13: J3.6
OC14: J3.14
RC9: J3.22
RC13: J3.21
U3RX: J2.4
U3TX: J2.12

### Notes on the sheet
- Connectors
- 2 * 23 pin connector
- ADC filtering
- @{"Id":"DZDVDSBZ\WNXXUAVV","ObjectType":1} ground from PDM (unfiltered)
- Mounting holes
- @{"Id":"DZDVDSBZ\ERZKJQEK","ObjectType":1} VCU internal reference (used to read external analog sensores)

### Library data of the parts
C37 C38 = CAP_0805_10V: Capacitor SMD 0805 10V
J2 J3 = 1-776087-5: CONN HDR 23POS R/A W/GASKET AU
R25-R28 = RES_0805: Resistor SMD 0805; Manufacturer: *; Manufacturer Part Number: *; Distributor Link: *; LCSC: *

## Nets that join several sheets
+3V3: PIC32_NVME (R1.1 R2.1 T1.2), POWER (C31.1 PS2.3 TP3.1), CAN (8 pins), OUTPUT (J2.7 J3.10)
+5V: PIC32_NVME (J1.1 J1.3), POWER (6 pins), CAN (8 pins), APPS (C33.2 IC7.8), MOSFETS (5 pins), OUTPUT (J2.15 J3.2)
+5V_APPS_1: POWER (C27.1 IC5.3 TP4.1), OUTPUT (J2.14)
+5V_APPS_2: POWER (C29.1 IC6.3 TP5.1), OUTPUT (J2.13)
+24V: POWER (6 pins), MOSFETS (JP1.2 JP3.2)
+24VBAT: POWER (D9.A), OUTPUT (J2.8 J3.9)
GND: PIC32_NVME (33 pins), POWER (20 pins), CAN (36 pins), APPS (10 pins), MOSFETS (5 pins), OUTPUT (13 pins)
GND_I: POWER (L2.1), OUTPUT (J2.22 J2.23 J3.1 J3.16)
AN9-APPS1: PIC32_NVME (J1.29), APPS (R17.2 R22.1 TP6.1)
AN10-APPS2: PIC32_NVME (J1.31), APPS (R18.1 R23.1 TP7.1)
AN14: PIC32_NVME (J1.24), OUTPUT (C38.1 R27.1 R28.1)
AN15: PIC32_NVME (J1.28), OUTPUT (C37.1 R25.1 R26.1)
APPS_1: APPS (R19.1 R21.2 TP8.1), OUTPUT (J2.6)
APPS_2: APPS (R20.2 R24.2 TP9.1), OUTPUT (J2.5)
CAN1_H: CAN (C9.1 D3.2 FL1.2 R8.1), OUTPUT (J2.9)
CAN1_L: CAN (C1.2 D1.1 FL1.3 R6.2), OUTPUT (J2.1)
CAN2_H: CAN (C10.1 D4.2 FL2.2 R9.1), OUTPUT (J2.2)
CAN2_L: CAN (C2.2 D2.1 FL2.3 R7.2), OUTPUT (J2.16)
CAN3_H: CAN (C19.1 D7.2 FL3.2 R12.1), OUTPUT (J2.17)
CAN3_L: CAN (C11.2 D5.1 FL3.3 R10.2), OUTPUT (J2.10)
CAN4_H: CAN (C20.1 D8.2 FL4.2 R13.1), OUTPUT (J2.11)
CAN4_L: CAN (C12.2 D6.1 FL4.3 R11.2), OUTPUT (J2.3)
GPIO_RB5: PIC32_NVME (J1.40), OUTPUT (J3.12)
GPIO_RB6: PIC32_NVME (J1.42), OUTPUT (J3.19)
GPIO_RB7: PIC32_NVME (J1.48), OUTPUT (J3.13)
GPIO_RC10: PIC32_NVME (J1.46), OUTPUT (J3.5)
INT1: PIC32_NVME (J1.35), OUTPUT (J3.4)
INT3: PIC32_NVME (J1.30), OUTPUT (J3.18)
MOSFET_A: MOSFETS (LED7.2 Q1.2 TP10.1), OUTPUT (J3.8)
MOSFET_B: MOSFETS (LED8.2 Q2.2 TP13.1), OUTPUT (J3.7)
OC12: PIC32_NVME (J1.64), OUTPUT (J3.20)
OC13: PIC32_NVME (J1.66), OUTPUT (J3.6)
OC14: PIC32_NVME (J1.70), OUTPUT (J3.14)
PWM11H: PIC32_NVME (J1.73), MOSFETS (IC8.2 TP11.1)
PWM12H: PIC32_NVME (J1.60), MOSFETS (IC8.4 TP12.1)
RC9: PIC32_NVME (J1.54), OUTPUT (J3.22)
RC13: PIC32_NVME (J1.52), OUTPUT (J3.21)
RX_CAN_1: PIC32_NVME (J1.53), CAN (IC1.4)
RX_CAN_2: PIC32_NVME (J1.41), CAN (IC2.4)
RX_CAN_3: PIC32_NVME (J1.43), CAN (IC3.4)
RX_CAN_4: PIC32_NVME (J1.9), CAN (IC4.4)
TX_CAN_1: PIC32_NVME (J1.47), CAN (IC1.1)
TX_CAN_2: PIC32_NVME (J1.49), CAN (IC2.1)
TX_CAN_3: PIC32_NVME (J1.37), CAN (IC3.1)
TX_CAN_4: PIC32_NVME (J1.23), CAN (IC4.1)
U3RX: PIC32_NVME (J1.34), OUTPUT (J2.4)
U3TX: PIC32_NVME (J1.36), OUTPUT (J2.12)